# EAGLE design schematic (EAGLE 7.7.0)
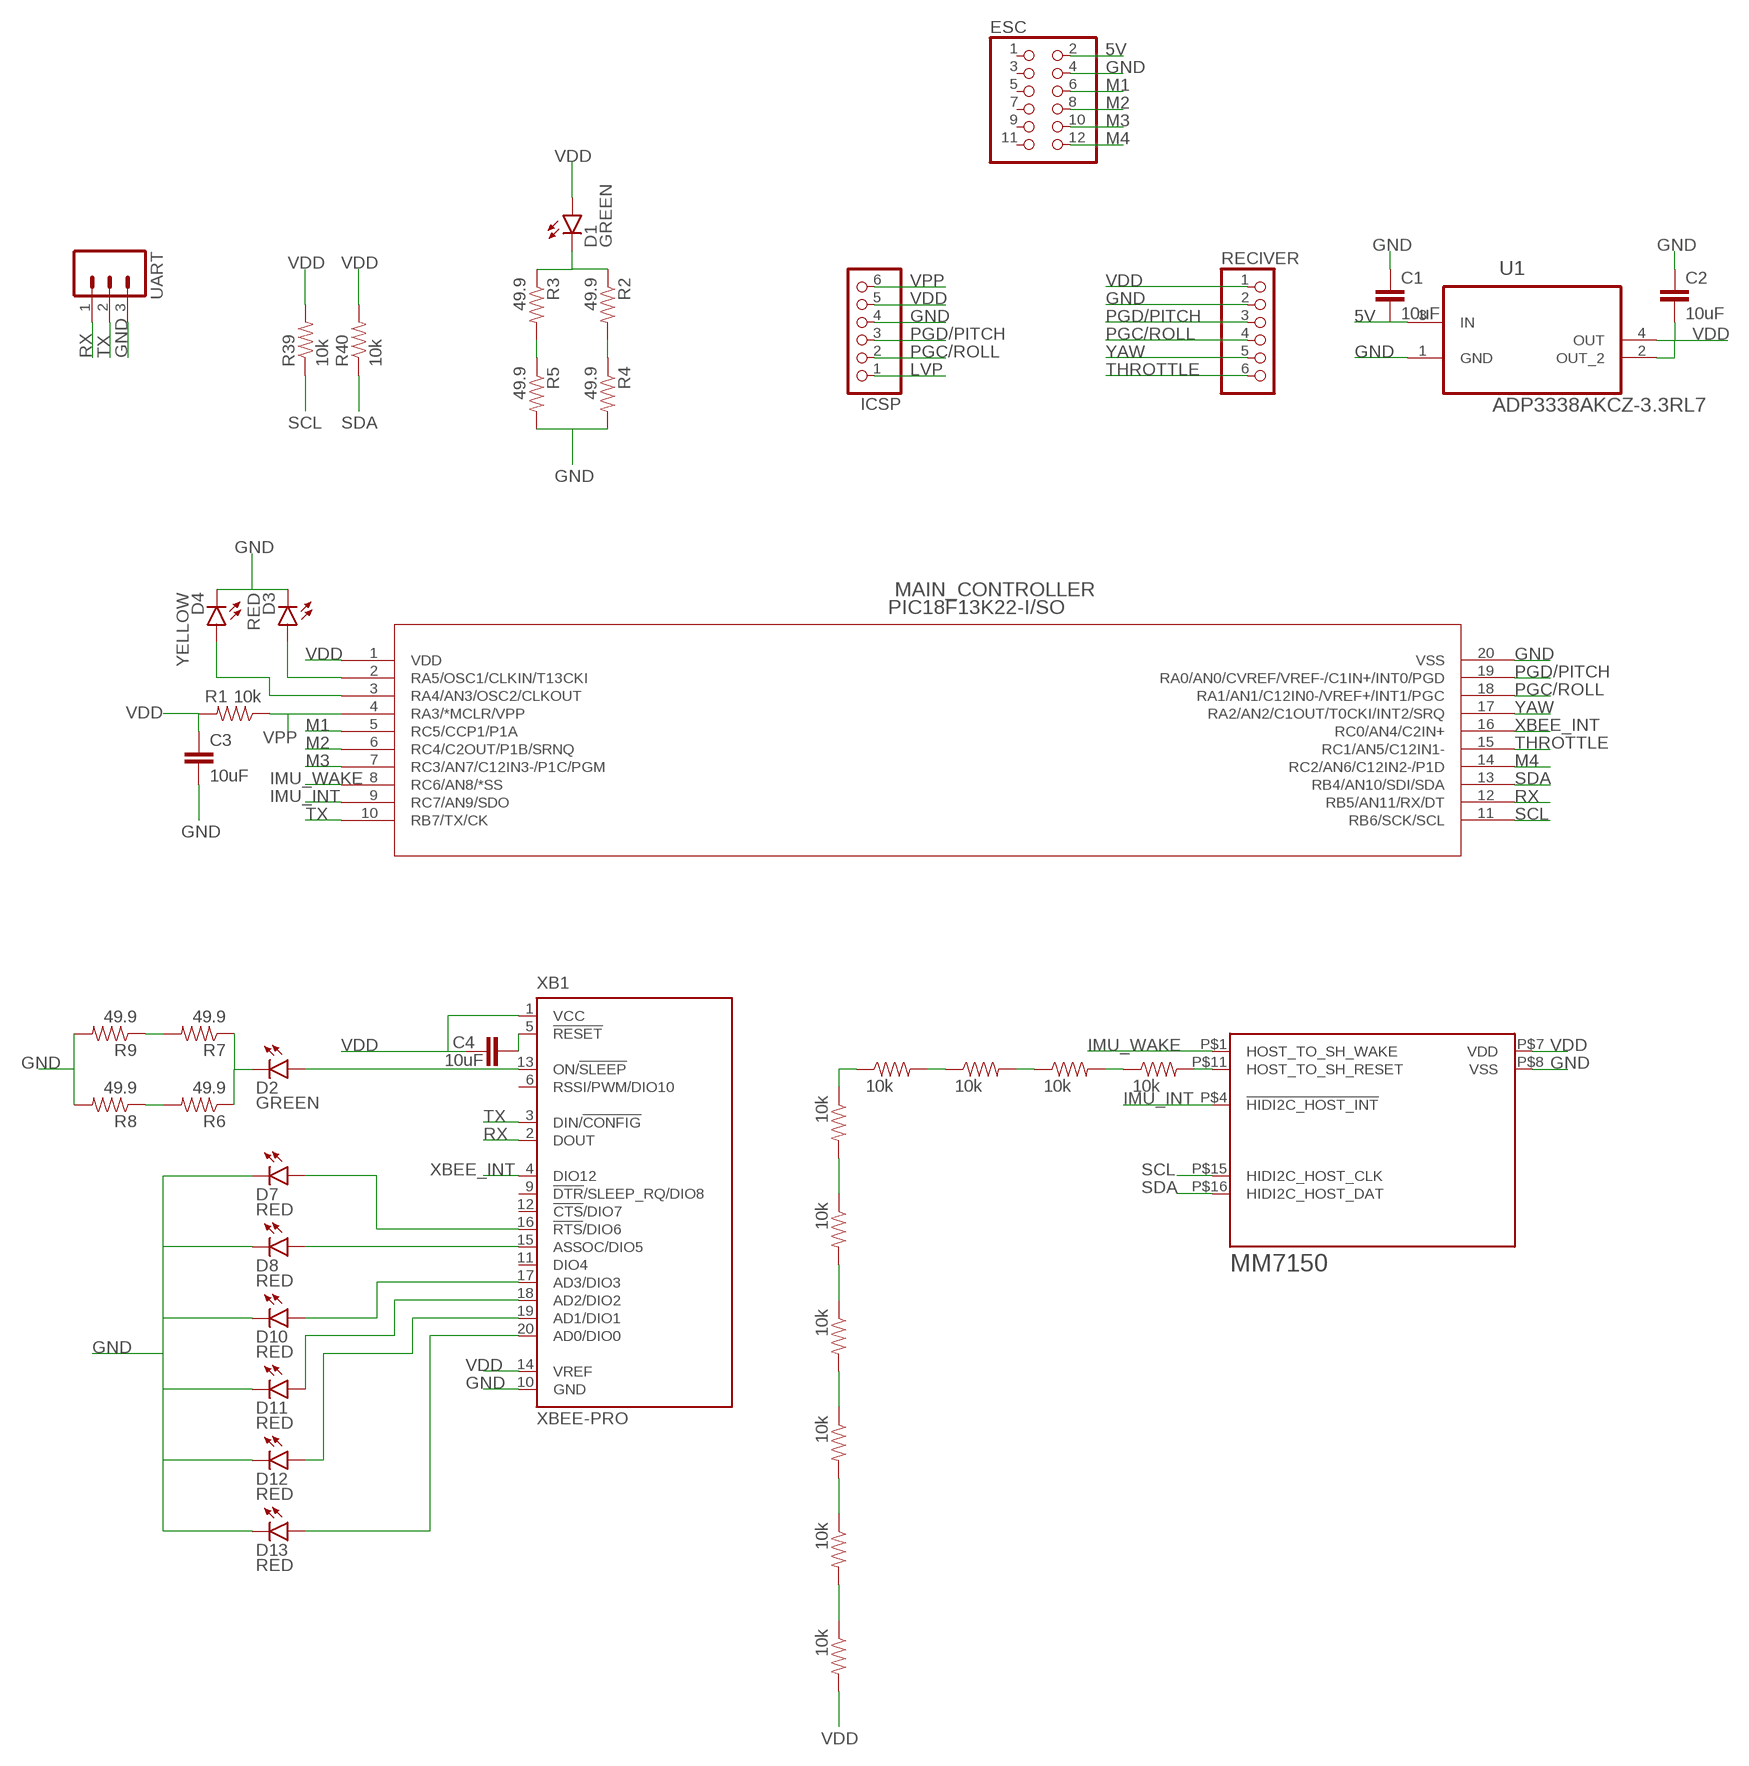
[diagram p0: schematic, sheet 1]

## Parts
C1  10uF  10UF50V20%(1210)  [1210]
C2  10uF  10UF50V20%(1210)  [1210]
C3  10uF  10UF50V20%(1210)  [1210]
C4  10uF  10UF50V20%(1210)  [1210]
D1  GREEN  LED-GREEN1206  [LED-1206]
D2  GREEN  LED-GREEN1206  [LED-1206]
D3  RED  LED-RED1206  [LED-1206]
D4  YELLOW  LED-YELLOW1206  [LED-1206]
D7  RED  LED-RED1206  [LED-1206]
D8  RED  LED-RED1206  [LED-1206]
D10  RED  LED-RED1206  [LED-1206]
D11  RED  LED-RED1206  [LED-1206]
D12  RED  LED-RED1206  [LED-1206]
D13  RED  LED-RED1206  [LED-1206]
ESC  PINHD-2X6  [2X06]
ICSP  PINHD-1X6/90  [1X06/90]
IMU  MM7150  [LANDPATTERN]
MAIN_CONTROLLER  PIC18F13K22-I/SO  [PIC18F13K22-X/SO]
R1  10k  RESISTOR0402-RES  [0402-RES]
R2  49.9  RESISTOR0402-RES  [0402-RES]
R3  49.9  RESISTOR0402-RES  [0402-RES]
R4  49.9  RESISTOR0402-RES  [0402-RES]
R5  49.9  RESISTOR0402-RES  [0402-RES]
R6  49.9  RESISTOR0402-RES  [0402-RES]
R7  49.9  RESISTOR0402-RES  [0402-RES]
R8  49.9  RESISTOR0402-RES  [0402-RES]
R9  49.9  RESISTOR0402-RES  [0402-RES]
R10  10k  RESISTOR0402-RES  [0402-RES]
R11  10k  RESISTOR0402-RES  [0402-RES]
R12  10k  RESISTOR0402-RES  [0402-RES]
R13  10k  RESISTOR0402-RES  [0402-RES]
R14  10k  RESISTOR0402-RES  [0402-RES]
R15  10k  RESISTOR0402-RES  [0402-RES]
R16  10k  RESISTOR0402-RES  [0402-RES]
R17  10k  RESISTOR0402-RES  [0402-RES]
R18  10k  RESISTOR0402-RES  [0402-RES]
R19  10k  RESISTOR0402-RES  [0402-RES]
R39  10k  RESISTOR0402-RES  [0402-RES]
R40  10k  RESISTOR0402-RES  [0402-RES]
RECIVER  PINHD-1X6  [1X06]
U1  ADP3338AKCZ-3.3RL7  [SOT230P700X180-4N]
UART  M03LONGPADS  [1X03_LONGPADS]
XB1  XBEE-PRO  [XBEE-PRO]

## Nets
5V: C1.2 ESC.2 U1.3(IN)
GND: C1.1 C2.1 C3.2 D3.C D4.C D7.C D8.C D10.C D11.C D12.C D13.C ESC.4 ICSP.4 IMU.P$8(VSS) MAIN_CONTROLLER.20(VSS) R4.2 R5.2 R8.2 R9.2 RECIVER.2 U1.1(GND) UART.3 XB1.10(GND)
IMU_INT: IMU.P$4(!HIDI2C_HOST_INT) MAIN_CONTROLLER.9(RC7/AN9/SDO)
IMU_WAKE: IMU.P$1(HOST_TO_SH_WAKE) MAIN_CONTROLLER.8(RC6/AN8/*SS)
LVP: ICSP.1
M1: ESC.6 MAIN_CONTROLLER.5(RC5/CCP1/P1A)
M2: ESC.8 MAIN_CONTROLLER.6(RC4/C2OUT/P1B/SRNQ)
M3: ESC.10 MAIN_CONTROLLER.7(RC3/AN7/C12IN3-/P1C/PGM)
M4: ESC.12 MAIN_CONTROLLER.14(RC2/AN6/C12IN2-/P1D)
N$1: D7.A XB1.16(!RTS!/DIO6)
N$2: R3.2 R5.1
N$3: R2.2 R4.1
N$4: D1.C R2.1 R3.1
N$5: C4.1 XB1.5(!RESET)
N$6: R7.2 R9.1
N$7: R6.2 R8.1
N$8: D2.C R6.1 R7.1
N$9: D2.A XB1.13(ON/!SLEEP)
N$10: IMU.P$11(HOST_TO_SH_RESET) R10.2
N$11: R10.1 R11.2
N$12: R11.1 R12.2
N$13: R12.1 R13.2
N$14: R13.1 R14.1
N$15: R14.2 R15.1
N$16: R15.2 R16.1
N$17: R16.2 R17.1
N$18: R17.2 R18.1
N$19: R18.2 R19.1
N$20: D10.A XB1.17(AD3/DIO3)
N$21: D11.A XB1.18(AD2/DIO2)
N$22: D12.A XB1.19(AD1/DIO1)
N$23: D13.A XB1.20(AD0/DIO0)
N$40: D3.A MAIN_CONTROLLER.2(RA5/OSC1/CLKIN/T13CKI)
N$41: D4.A MAIN_CONTROLLER.3(RA4/AN3/OSC2/CLKOUT)
N$44: D8.A XB1.15(ASSOC/DIO5)
PGC/ROLL: ICSP.2 MAIN_CONTROLLER.18(RA1/AN1/C12IN0-/VREF+/INT1/PGC) RECIVER.4
PGD/PITCH: ICSP.3 MAIN_CONTROLLER.19(RA0/AN0/CVREF/VREF-/C1IN+/INT0/PGD) RECIVER.3
RX: MAIN_CONTROLLER.12(RB5/AN11/RX/DT) UART.1 XB1.2(DOUT)
SCL: IMU.P$15(HIDI2C_HOST_CLK) MAIN_CONTROLLER.11(RB6/SCK/SCL) R39.1
SDA: IMU.P$16(HIDI2C_HOST_DAT) MAIN_CONTROLLER.13(RB4/AN10/SDI/SDA) R40.1
THROTTLE: MAIN_CONTROLLER.15(RC1/AN5/C12IN1-) RECIVER.6
TX: MAIN_CONTROLLER.10(RB7/TX/CK) UART.2 XB1.3(DIN/!CONFIG)
VDD: C2.2 C3.1 C4.2 D1.A ICSP.5 IMU.P$7(VDD) MAIN_CONTROLLER.1(VDD) R1.2 R19.2 R39.2 R40.2 RECIVER.1 U1.2(OUT_2) U1.4(OUT) XB1.1(VCC) XB1.14(VREF)
VPP: ICSP.6 MAIN_CONTROLLER.4(RA3/*MCLR/VPP) R1.1
XBEE_INT: MAIN_CONTROLLER.16(RC0/AN4/C2IN+) XB1.4(DIO12)
YAW: MAIN_CONTROLLER.17(RA2/AN2/C1OUT/T0CKI/INT2/SRQ) RECIVER.5
Unconnected: ESC.1 ESC.3 ESC.5 ESC.7 ESC.9 ESC.11 XB1.6(RSSI/PWM/DIO10) XB1.9(!DTR!/SLEEP_RQ/DIO8) XB1.11(DIO4) XB1.12(!CTS!/DIO7)

## Library data of the parts
C1-C4 = SparkFun-Capacitors:10UF50V20%(1210): CAP-09824; PROD_ID: CAP-09824
D1 D2 = SparkFun-LED:LED-GREEN: Various green LEDs Green LEDs used in SFE Production 0603- DIO-00821 LARGE- DIO-00862 LILYPAD- DIO-09910; PROD_ID: DIO-00862
D3 D7 D8 D10-D13 = SparkFun-LED:LED-RED: Assorted Red LEDs LilyPad 1206- DIO-09912 1206- DIO-00809 0603- DIO-00819 "SMART" means more efficient and expensive; PROD_ID: DIO-09912
D4 = SparkFun-LED:LED-YELLOW: Yellow SMD LEDs LilyPad 1206- DIO-09909 0603- DIO-09003 "SMART" means more efficient and expensive; PROD_ID: DIO-00820
ESC = pinhead:PINHD-2X6: PIN HEADER
ICSP RECIVER = pinhead:PINHD-1X6: PIN HEADER
IMU = MM7150:MM7150: The MM7150 Motion Module is a simple, cost-effective solution for integrating motion and positioning data into a wide range of applications. The module contains the SSC7150 motion coprocessor with integrated 9-axis sensor fusion as well as high performance MEMS tech- nology including a 3-axis accelerometer, gyroscope and magnetometer. All components are integrated, cal- ibrated and available on the module for PCB mounting.
MAIN_CONTROLLER = PIC18F13K22-I_SO:PIC18F13K22-I/SO
R1-R19 R39 R40 = SparkFun-Passives:RESISTOR: Resistor Basic schematic elements and footprints for 0603, 1206, and PTH resistors.
U1 = ADP3338AKCZ-3.3RL7:ADP3338AKCZ-3.3RL7: Low Dropout Regulator
UART = SparkFun-Connectors:M03: Header 3 Standard 3-pin 0.1" header. Use with straight break away headers (SKU : PRT-00116), right angle break away headers (PRT-00553), swiss pins (PRT-00743), machine pins (PRT-00117), and female headers (PRT-00115). Molex polarized connector foot print use with SKU : PRT-08232 with associated crimp pins and housings.
XB1 = xbee:XBEE: XBee (TM) /XBee-PRO(TM) OEM RF Modules Source: MaxStream, Inc. xbee_productmanual.pdf; MPN: XBP24-AWI-001; OC_FARNELL: 1337916; OC_NEWARK: 42M2667

## Board
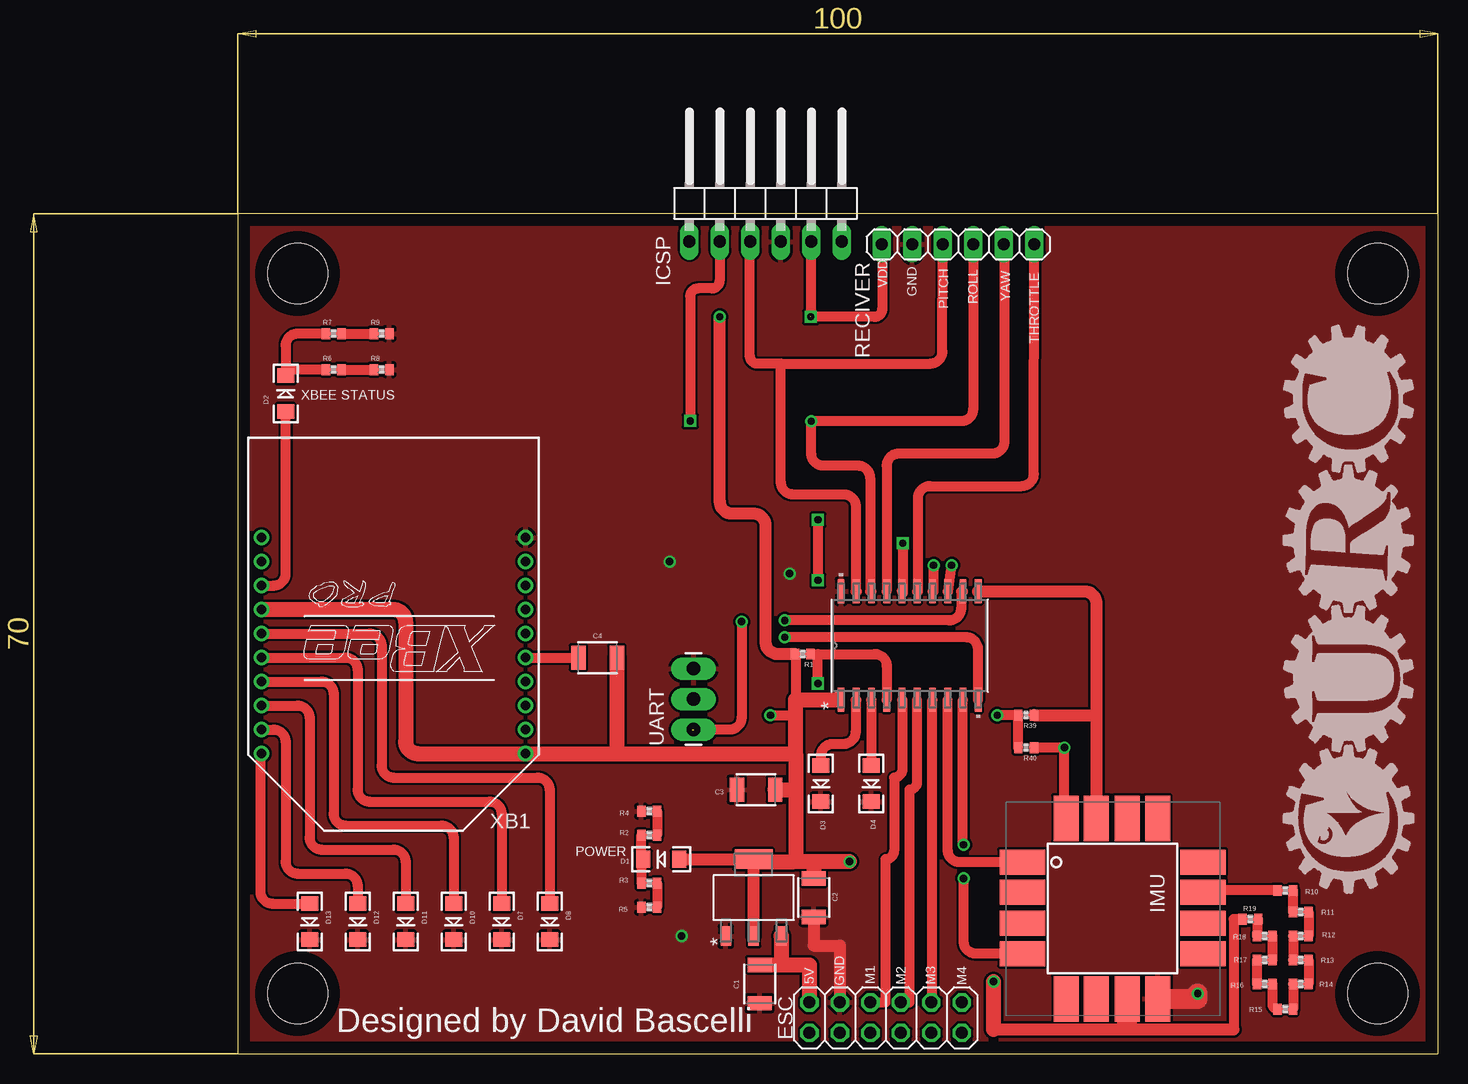
[diagram p1: board, top side]
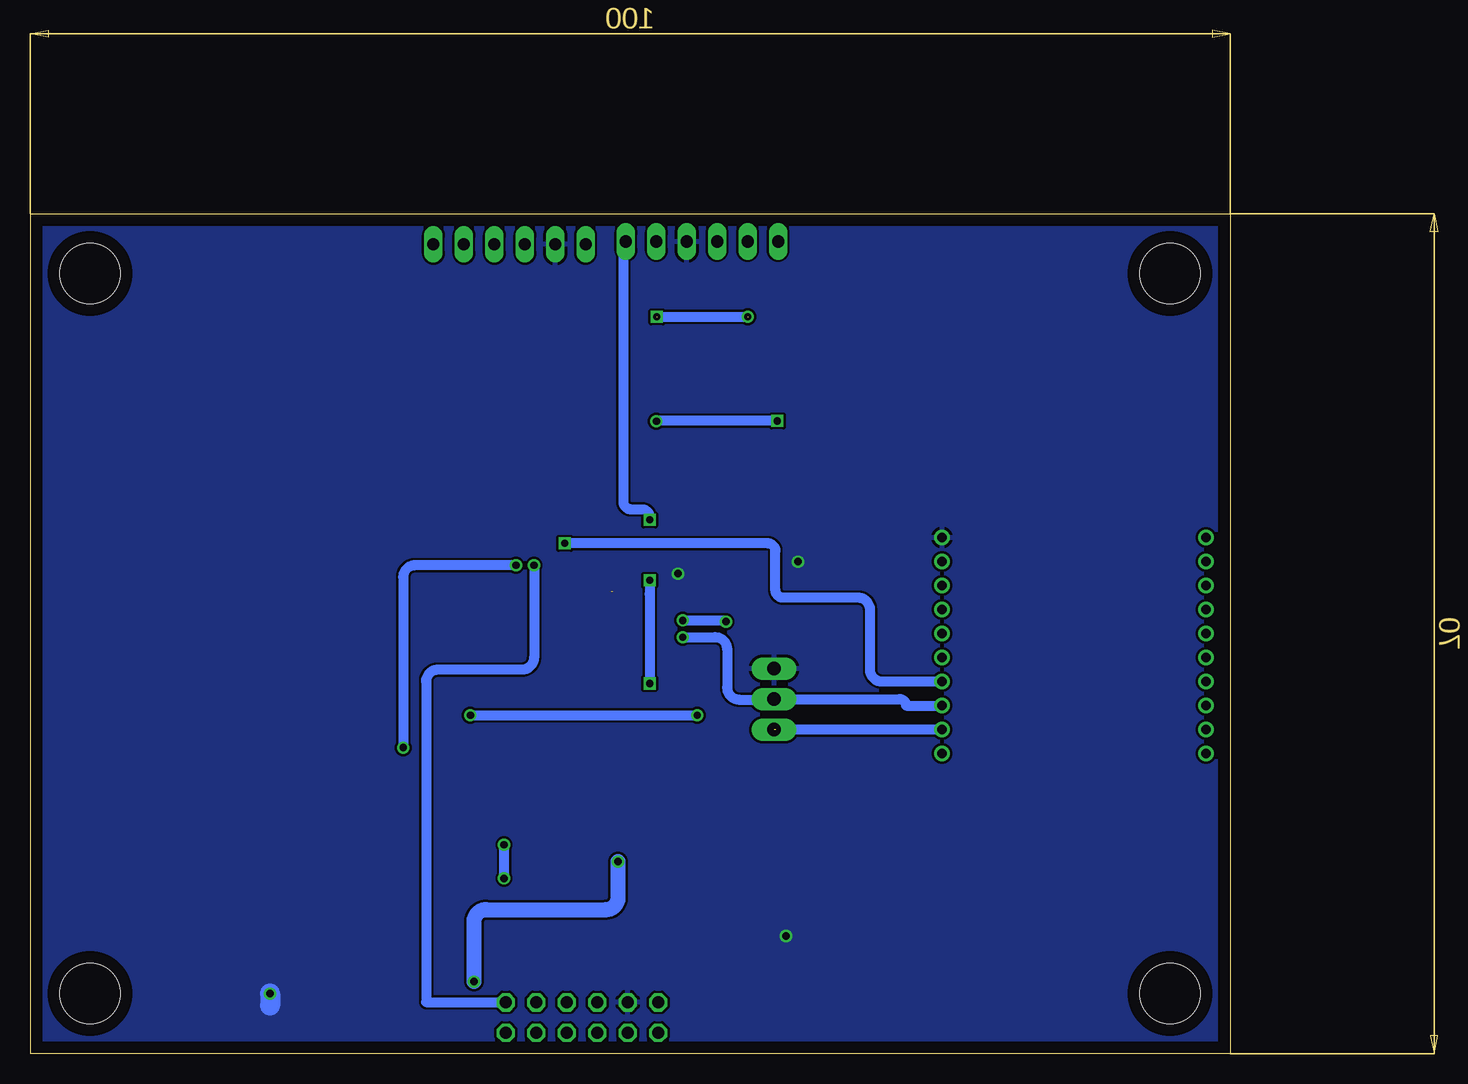
[diagram p2: board, bottom side, seen from below]

Size 100 x 70 mm. Coordinates in mm from the lower left corner, seen from the top.
Outline: 0,0 100,0 100,70 0,70 0,0
Copper layers (1*16): Top 0.035mm / dielectric 1.5mm / Bottom 0.035mm
Design rules "default": minimum track width 10mil, minimum drill 24mil, track to track 8mil, track to pad 8mil, pad to pad 8mil, via to via 8mil, smd to smd 8mil, copper to edge 40mil, drill to drill 8mil, minimum pad ring 10mil, minimum via ring 8mil, stop-mask expansion 4mil, vias tented up to drill 0mil, thermal gap 10mil
Holes 5 mm at 5,65 5,5 95,5 95,65

### Footprints (pad centres in the part's own frame; a part is rotated, then mirrored left to right if it is on the bottom)
1210 = smd 1.2 x 2: 1 -1.6,0; 2 1.6,0
LED-1206 = smd 1.2 x 1.4: A -1.5,0; C 1.5,0
2X06 = drill 1.016 octagon: 1 -6.35,-1.27; 2 -6.35,1.27; 3 -3.81,-1.27; 4 -3.81,1.27; 5 -1.27,-1.27; 6 -1.27,1.27; 7 1.27,-1.27; 8 1.27,1.27; 9 3.81,-1.27; 10 3.81,1.27; 11 6.35,-1.27; 12 6.35,1.27
1X06/90 = drill 1.016 long: 1 -6.35,-3.81; 2 -3.81,-3.81; 3 -1.27,-3.81; 4 1.27,-3.81; 5 3.81,-3.81; 6 6.35,-3.81
LANDPATTERN = smd 2.08 x 3.8: P$1 5.04,1.4; P$2 7.57,1.4; P$3 10.12,1.4; P$4 12.66,1.4; P$9 12.66,16.44; P$10 10.12,16.44; P$11 7.57,16.44; P$12 5.04,16.44 | smd 3.8 x 2.08: P$5 16.44,5.04; P$6 16.44,7.57; P$7 16.44,10.12; P$8 16.44,12.66; P$13 1.4,12.66; P$14 1.4,10.12; P$15 1.4,7.57; P$16 1.4,5.04
PIC18F13K22-X/SO = smd 1.981 x 0.559: 1 -4.521,5.715; 2 -4.521,4.445; 3 -4.521,3.175; 4 -4.521,1.905; 5 -4.521,0.635; 6 -4.521,-0.635; 7 -4.521,-1.905; 8 -4.521,-3.175; 9 -4.521,-4.445; 10 -4.521,-5.715; 11 4.521,-5.715; 12 4.521,-4.445; 13 4.521,-3.175; 14 4.521,-1.905; 15 4.521,-0.635; 16 4.521,0.635; 17 4.521,1.905; 18 4.521,3.175; 19 4.521,4.445; 20 4.521,5.715
0402-RES = smd 0.7 x 0.9: 1 -0.65,0; 2 0.65,0
1X06 = drill 1.016 long: 1 -6.35,0; 2 -3.81,0; 3 -1.27,0; 4 1.27,0; 5 3.81,0; 6 6.35,0
SOT230P700X180-4N = smd 1.626 x 0.889: 1 -3.2,2.311; 2 -3.2,0; 3 -3.2,-2.311 | smd 1.626 x 3.175: 4 3.2,0
1X03_LONGPADS = drill 1.118 pad 1.88 long: 1 0,0; 2 2.54,0; 3 5.08,0
XBEE-PRO = drill 0.8 pad 1.27: 1 -11,9; 2 -11,7; 3 -11,5; 4 -11,3; 5 -11,1; 6 -11,-1; 7 -11,-3; 8 -11,-5; 9 -11,-7; 10 -11,-9; 11 11,-9; 12 11,-7; 13 11,-5; 14 11,-3; 15 11,-1; 16 11,1; 17 11,3; 18 11,5; 19 11,7; 20 11,9

### Placement (x,y rotation side)
C1  43.5,5.8 90 top
C2  48,13 90 top
C3  43.2,22 180 top
C4  30,33 0 top
D1  35.3,16.2 180 top
D2  4,55 90 top
D3  48.6,22.5 270 top
D4  52.8,22.5 270 top
D7  22,11 270 top
D8  26,11 270 top
D10  18,11 270 top
D11  14,11 270 top
D12  10,11 270 top
D13  6,11 270 top
ESC  54,3 0 top
ICSP  44,71.48 0 top
IMU  64,21 270 top
MAIN_CONTROLLER  56,34 90 top
R1  47.1,33.3 180 top
R2  34.3,18.2 0 top
R3  34.3,14.2 0 top
R4  34.3,20.2 180 top
R5  34.3,12.2 180 top
R6  8,57 0 top
R7  8,60 0 top
R8  12,57 0 top
R9  12,60 0 top
R10  87.3,13.6 180 top
R11  88.6,11.8 180 top
R12  88.6,9.8 0 top
R13  88.6,7.8 180 top
R14  88.6,5.8 180 top
R15  87.3,3.7 180 top
R16  85.6,5.8 180 top
R17  85.6,7.8 0 top
R18  85.6,9.8 180 top
R19  84.4,11.2 180 top
R39  65.7,28.2 180 top
R40  65.7,25.5 180 top
RECIVER  60.04,67.44 0 top
U1  43,13 90 top
U$1  [A5L-LOC]  -45,-30 0 top  (outside the outline)
UART  38,27 90 top
XB1  13,34 180 top

### Tracks (layer width: path | path; a pad name or v marks a point on that pad's centre or on a via)
5V
  Top 1.27: U1.3 | C1.2 45.3,7.4 | 45.3,7.4 47.65,7.4 ESC.2 | U1.3 45.3,7.4
GND  (via drill 0.6)
  Top 1.016: C2.1 48,9 50.19,9 ESC.4
  Top 1.676: IMU.P$8 80,4.56 v80,5
  Bottom 1.676: v80,5 80,4
  other vias: 46,40 37,9.8 36,41
  pour Top: 0,0 100,0 100,70 0,70
  pour Bottom: 0,70 100,70 100,0 0,0
IMU_INT  (via drill 0.6)
  Top 0.813: IMU.P$4 61.5,8.34 arc-90 60.5,9.34 v60.5,14.6 | v60.5,17.4 60.45,17.4 MAIN_CONTROLLER.9
  Bottom 0.813: v60.5,14.6 v60.5,17.4
IMU_WAKE
  Top 0.813: IMU.P$1 60.17,15.96 arc-90 59.17,16.96 MAIN_CONTROLLER.8
M1
  Top 0.813: ESC.6 54,4.27 54,16.2 arc90 54.7,16.9 54.7,23 arc90 55.4,23.7 55.4,29.48 MAIN_CONTROLLER.5
M2
  Top 0.813: ESC.8 56,4.27 56,22 arc90 56.63,22.64 MAIN_CONTROLLER.6
M3
  Top 0.813: ESC.10 57.91,4.27 MAIN_CONTROLLER.7
M4  (via drill 0.6)
  Top 0.813: MAIN_CONTROLLER.14 58,38.52 v58,40.7
  Bottom 0.813: v58,40.7 58,33 arc90 59,32 66,32 arc-90 67,31 67,4.3 60.38,4.3 ESC.12
N$1
  Top 0.813: XB1.16 9,33 arc-90 10,32 10,22 arc90 11,21 21,21 arc-90 22,20 D7.A
N$2
  Top 0.813: R3.2 R5.1
N$3
  Top 0.813: R4.1 R2.2
N$4
  Top 0.813: 33.65,16.2 R3.1 | D1.C 33.65,16.2 | 33.65,16.2 R2.1
N$5
  Top 0.813: XB1.5 C4.1
N$6
  Top 0.813: R7.2 R9.1
N$7
  Top 0.813: R6.2 R8.1
N$8
  Top 0.813: R6.1 4.5,57 arc90 D2.C 4,59 arc-90 5,60 R7.1
N$9
  Top 0.813: XB1.13 3,39 arc90 4,40 D2.A
N$10
  Top 0.813: R10.2 80.44,13.6 IMU.P$11
N$11
  Top 0.813: R11.2 R10.1
N$12
  Top 0.813: R11.1 R12.2
N$13
  Top 0.813: R12.1 R13.2
N$14
  Top 0.813: R13.1 R14.1
N$15
  Top 0.813: R14.2 R15.1
N$16
  Top 0.813: R15.2 arc-90 86.25,4.1 R16.1
N$17
  Top 0.813: R16.2 R17.1
N$18
  Top 0.813: R17.2 R18.1
N$19
  Top 0.813: R18.2 R19.1
N$20
  Top 0.813: XB1.17 7,31 arc-90 8,30 8,20 arc90 9,19 17,19 arc-90 18,18 D10.A
N$21
  Top 0.813: XB1.18 5,29 arc-90 6,28 6,18 arc90 7,17 13,17 arc-90 14,16 D11.A
N$22
  Top 0.813: XB1.19 3,27 arc-90 4,26 4,16 arc90 5,15 9,15 arc-90 10,14 D12.A
N$23
  Top 0.813: XB1.20 1.9,25 1.9,13.5 arc90 2.9,12.5 D13.A
N$40
  Top 0.813: MAIN_CONTROLLER.2 51.5,29.48 51.5,26.8 arc-90 50.5,25.8 49.6,25.8 arc90 48.6,24.8 D3.A
N$41
  Top 0.813: MAIN_CONTROLLER.3 52.8,29.48 D4.A
N$44
  Top 0.813: XB1.15 11,35 arc-90 12,34 12,24 arc90 13,23 25,23 arc-90 26,22 D8.A
PGC/ROLL  (via drill 0.6)
  Top 0.813: MAIN_CONTROLLER.18 52.7,38.52 52.7,48 arc90 51.7,49 48.8,49 arc-90 47.8,50 v47.8,52.7 60.3,52.7 arc90 61.3,53.7 61.3,68 RECIVER.4 | ICSP.2 40.16,67.67 40.16,64.39 arc-90 39.52,63.76 38.35,63.76 arc90 37.72,63.12 v37.72,52.72
  Bottom 0.813: v37.72,52.72 47.8,52.72 v47.8,52.7
PGD/PITCH  (1 unrouted)
  Top 0.813: MAIN_CONTROLLER.19 51.5,38.52 | 45.27,57.5 45.27,47.6 arc90 46.27,46.6 50.52,46.6 arc-90 51.52,45.6 51.52,38.52 | 45.27,57.5 57.73,57.5 arc90 58.73,58.5 RECIVER.3 | 51.52,38.48 51.52,38.52 | 51.52,38.52 51.6,38.52 | 45.27,57.5 43.31,57.5 arc-90 42.68,58.13 42.68,67.6 42.73,67.6 ICSP.3
RX  (via drill 0.6)  (1 unrouted)
  Top 0.813: MAIN_CONTROLLER.12 60.3,38.52 60.3,37.1 arc-90 59.3,36.1 v45.6,36.1 | v42,36 42,28 arc-90 41,27 UART.1
  Bottom 0.813: v45.6,36.1 42,36.1 v42,36 | XB1.2 37.87,27 37.87,27.14 38.15,27.14 38.15,26.97
SCL
  Top 0.813: 61.72,38.5 MAIN_CONTROLLER.11
  Top 1.016: MAIN_CONTROLLER.11 70.57,38.52 arc-90 71.57,37.52 71.57,28.2 | 71.57,28.2 IMU.P$15 | R39.1 71.57,28.2
SDA  (via drill 0.6)
  Top 0.813: MAIN_CONTROLLER.13 59.2,38.52 v59.5,40.7 | R40.1 v68.9,25.5 68.9,19.6 IMU.P$16
  Bottom 0.813: v59.5,40.7 67.9,40.7 arc-90 68.9,39.7 v68.9,25.5
THROTTLE
  Top 0.813: MAIN_CONTROLLER.15 56.7,38.52 56.7,46.3 arc-90 57.7,47.3 65.35,47.3 arc90 66.35,48.3 RECIVER.6
TX  (via drill 0.6)
  Top 0.813: MAIN_CONTROLLER.10 61.7,29.48 61.7,33.7 arc90 60.7,34.7 v45.6,34.7
  Bottom 0.813: v45.6,34.7 42.9,34.7 arc90 41.9,33.7 41.9,30.5 arc-90 40.9,29.5 38,29.5 UART.2 27.54,29.54 arc90 27,29 XB1.3
VDD  (via drill 0.6)  (2 unrouted)
  Top 0.254: 74.1,2.4 74,2.4 74,2
  Top 0.305: 49.9,29.5 50.28,29.5 MAIN_CONTROLLER.1
  Top 0.406: 46.5,16.2 46.4,16.2 46.4,16
  Top 0.61: 31.6,25 31.6,25.2
  Top 0.813: R1.2 46.5,33.3 46.5,29.5 | R40.2 R39.2 v63.3,28.2 | v44.4,28.2 46.5,28.2 | R19.2 83,11.2 83,2 | ICSP.5 47.76,67.67 v47.76,61.4 | RECIVER.1 53.72,67.44 53.72,62.03 arc-90 53.09,61.4 47.72,61.4
  Top 1.016: D1.A U1.4 | U1.4 | U1.2 43,16 | 46.5,26.1 46.5,26 | R1.2 45,33.3 arc-90 44,34.3 44,44 arc90 43,45 41.19,45 arc-90 40.19,46 v40.19,61.4 | 46.5,26.6 46.5,27 | 83,2 74,2 63,2
  Top 1.27: U1.4 43,16 46.4,16 48,16 | 46.5,25 46.5,26 46.5,27 46.5,28.2 46.5,29.5 49.9,29.5 | XB1.14 13,37 arc-90 14,36 14,26 arc90 15,25 XB1.1 31.6,25 46.5,25 | 46.5,25 46.5,22 | 46.5,22 46.5,16.2 | C4.2 31.6,25.2 | 48,16 C2.2 | IMU.P$7 74,4.56 | 63,2 v63,6 | v51,16 48,16 | C3.1 46.5,22
  Top 1.676: 74,4.56 74.1,4.56 74.1,2.4
  Bottom 0.813: v63.3,28.2 v44.4,28.2 | v47.76,61.4 40.16,61.4 40.16,61.44
  Bottom 1.27: v63,6 63,11 arc90 62,12 52,12 arc-90 51,13 v51,16
VPP  (via drill 0.6)
  Top 0.813: R1.1 48.36,33.3 | 48.36,33.3 53.09,33.3 arc-90 54.09,32.3 MAIN_CONTROLLER.4 | v48.36,30.84 48.36,33.3 | v48.36,44.48 v48.36,39.44
  Bottom 0.813: v48.36,30.84 48.36,38.28 48.36,38.32 v48.36,39.44 | ICSP.6 50.56,67.67 50.56,45.99 arc-90 49.92,45.36 48.99,45.36 arc90 48.36,44.73 v48.36,44.48
XBEE_INT  (via drill 0.6)
  Top 0.813: v55.44,42.52 55.44,38.48 | 55.44,38.48 55.44,38.4 | MAIN_CONTROLLER.16 | MAIN_CONTROLLER.16 55.36,38.48 55.44,38.48 | MAIN_CONTROLLER.16 55.36,38.6
  Bottom 0.813: XB1.4 29,31 arc90 30,32 30,37 arc-90 31,38 37.24,38 arc90 37.88,38.63 37.88,41.88 arc-90 38.52,42.52 v55.44,42.52
YAW
  Top 0.813: RECIVER.5 63.9,68 63.9,51 arc-90 62.9,50 55.09,50 arc90 54.09,49 MAIN_CONTROLLER.17

### Text on the board
Dimension: PCB rev.1 for / CURC drone | David Bascelli | 1 of 1
tPlace: VDD | GND | YAW | PITCH | ROLL | THROTTLE | XBEE STATUS | POWER | 5V | GND | M1 | M2 | M3 | M4 | Designed by David Bascelli